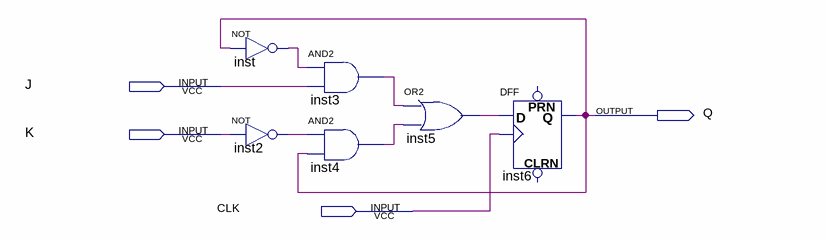
[diagram p0: schematic sheet]
// Quartus schematic d_jk.bdf as structural Verilog: 6 symbols, 4 pins
module d_jk (
  input  J,
  input  K,
  input  CLK,
  output Q
);

  wire inst2_out, inst3_out, inst4_out, inst5_out, inst_out;

  not inst (inst_out, Q);
  not inst2 (inst2_out, K);
  and inst3 (inst3_out, inst_out, J);
  and inst4 (inst4_out, inst2_out, Q);
  or inst5 (inst5_out, inst3_out, inst4_out);
  DFF inst6 (.CLK(CLK), .D(inst5_out), .Q(Q));  // open: CLRN, PRN
endmodule
